# EAGLE schematic Voltage_Divider (EAGLE 8.6.1)
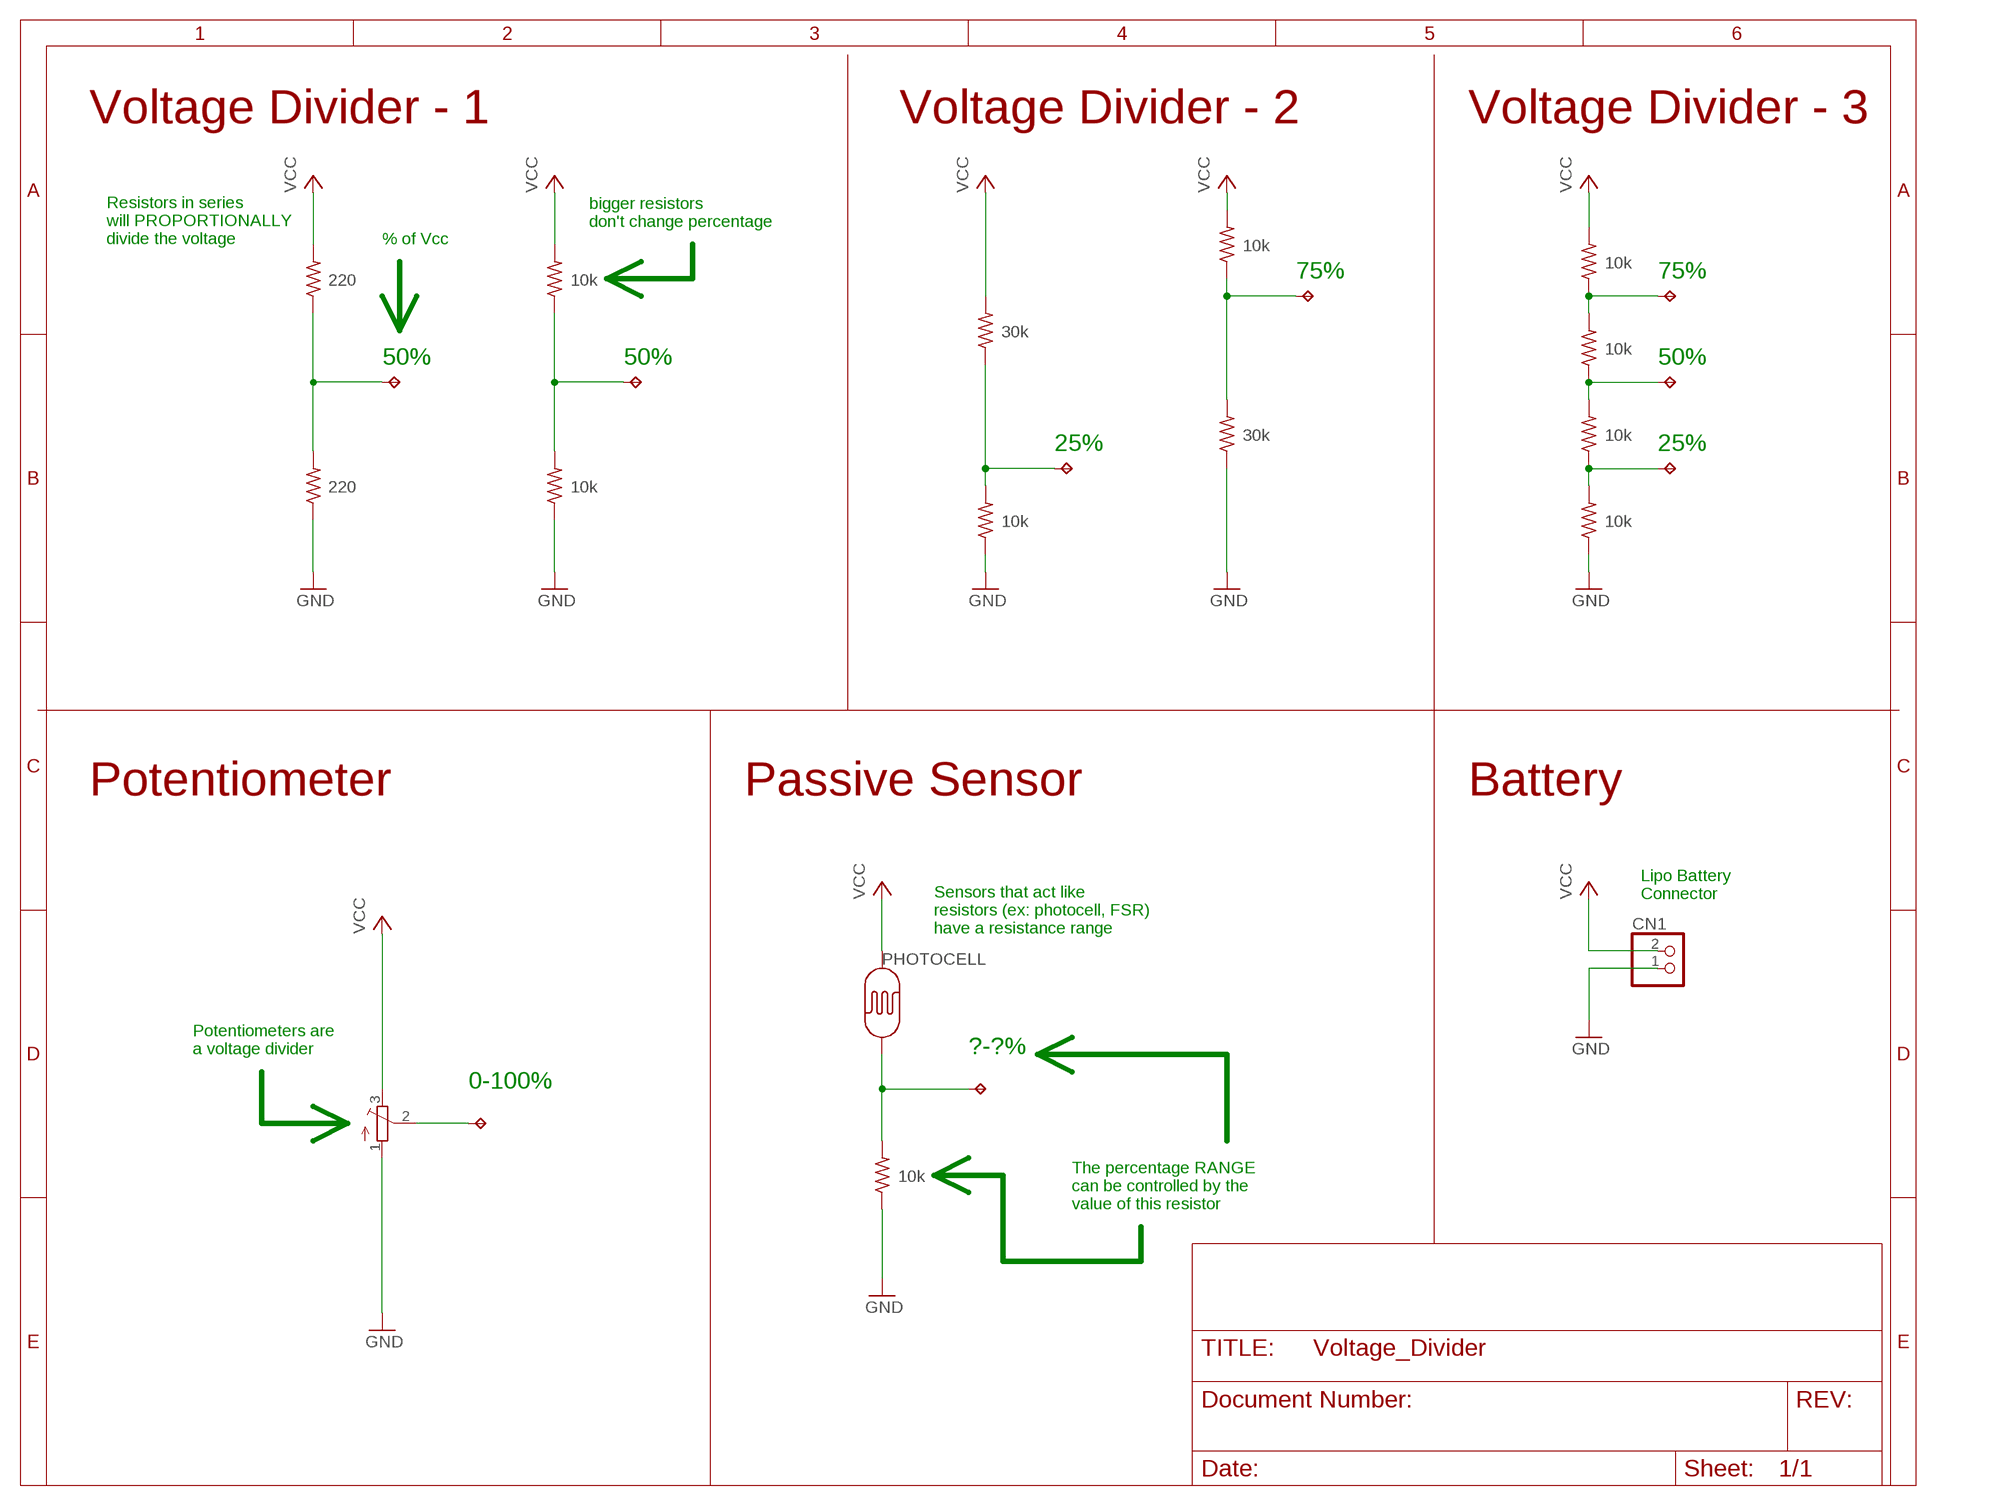
[diagram p0: schematic, sheet 1]

## Parts
CN1  JST_2PIN-SMT-RA  [JST-PH-2-SMT-RA]
PHOTOCELL  PHOTOCELLPTH  [PHOTOCELL]
R1  220  R-US_R0603  [R0603]
R2  220  R-US_R0603  [R0603]
R3  10k  R-US_R0603  [R0603]
R4  10k  R-US_R0603  [R0603]
R5  30k  R-US_R0603  [R0603]
R6  10k  R-US_R0603  [R0603]
R7  10k  R-US_R0603  [R0603]
R8  30k  R-US_R0603  [R0603]
R9  10k  R-US_R0603  [R0603]
R10  10k  R-US_R0603  [R0603]
R11  10k  R-US_R0603  [R0603]
R12  10k  R-US_R0603  [R0603]
R14  10k  R-US_R0603  [R0603]
TM1  TRIMPOTTC33X  [TC33X]
TP1  TPTP20R  [TP20R]
TP2  TPTP20R  [TP20R]
TP3  TPTP20R  [TP20R]
TP4  TPTP20R  [TP20R]
TP5  TPTP20R  [TP20R]
TP6  TPTP20R  [TP20R]
TP7  TPTP20R  [TP20R]
TP8  TPTP20R  [TP20R]
TP9  TPTP20R  [TP20R]

## Nets
GND: CN1.1 R2.1 R4.1 R6.1 R8.1 R12.1 R14.1 TM1.1(A)
N$1: R1.1 R2.2 TP1.TP
N$2: R3.1 R4.2 TP2.TP
N$3: R5.1 R6.2 TP3.TP
N$4: R7.1 R8.2 TP4.TP
N$5: TM1.2(S) TP5.TP
N$7: R9.1 R10.2 TP6.TP
N$8: R11.1 R12.2 TP8.TP
N$9: R10.1 R11.2 TP7.TP
N$11: PHOTOCELL.1 R14.2 TP9.TP
VCC: CN1.2 PHOTOCELL.2 R1.2 R3.2 R5.2 R7.2 R9.2 TM1.3(E)

## Notes on the sheet
- Voltage Divider - 1 | Voltage Divider - 2 | Voltage Divider - 3
- bigger resistors
  don't change percentage
- Resistors in series
  will PROPORTIONALLY
  divide the voltage
- % of Vcc
- 75% | 75%
- 50% | 50% | 50%
- 25% | 25%
- Potentiometer | Passive Sensor | Battery
- Lipo Battery
  Connector
- Sensors that act like
  resistors (ex: photocell, FSR)
  have a resistance range
- Potentiometers are
  a voltage divider
- ?-?%
- 0-100%
- The percentage RANGE
  can be controlled by the
  value of this resistor

## Library data of the parts
CN1 = adafruit:JST_2PIN: JST 2-Pin Connectors of various flavors SMT-RA (S2B-PH-SM4) 4UConnector #17311 SMT (B2B-PH-SM4) THM-RA (S2B-PH) THM (B2B-PH)
PHOTOCELL = SparkFun-Sensors:PHOTOCELL: Photocell (Photodetector, Photo Resistor, CdS) This is a very small light sensor. A photocell changes (also called a photodetector, photo resistor, CdS or photoconductive cell) resistance depending on the amount of light it is exposed to. These little sensors make great ambient light triggers (when light in the room turns on, do something). Datasheet <http://cdn.sparkfun.com/datasheets/Sensors/LightImaging/SEN-09088.pdf> SparkFun Products Mini Photocell <https://www.sparkfun.com/products/9088> (SEN-09088); PROD_ID: COMP-09129; SF_ID: SEN-09088
R1-R12 R14 = adafruit:R-US_: RESISTOR, American symbol
TM1 = adafruit:TRIMPOT: SMT trimmer potentiometer part number TC33X http://www.ladyada.net/library/eagle
TP1-TP9 = testpad:TP: Test pad